# EAGLE design LilyPad-Accelerometer-v20 (EAGLE 5.04)
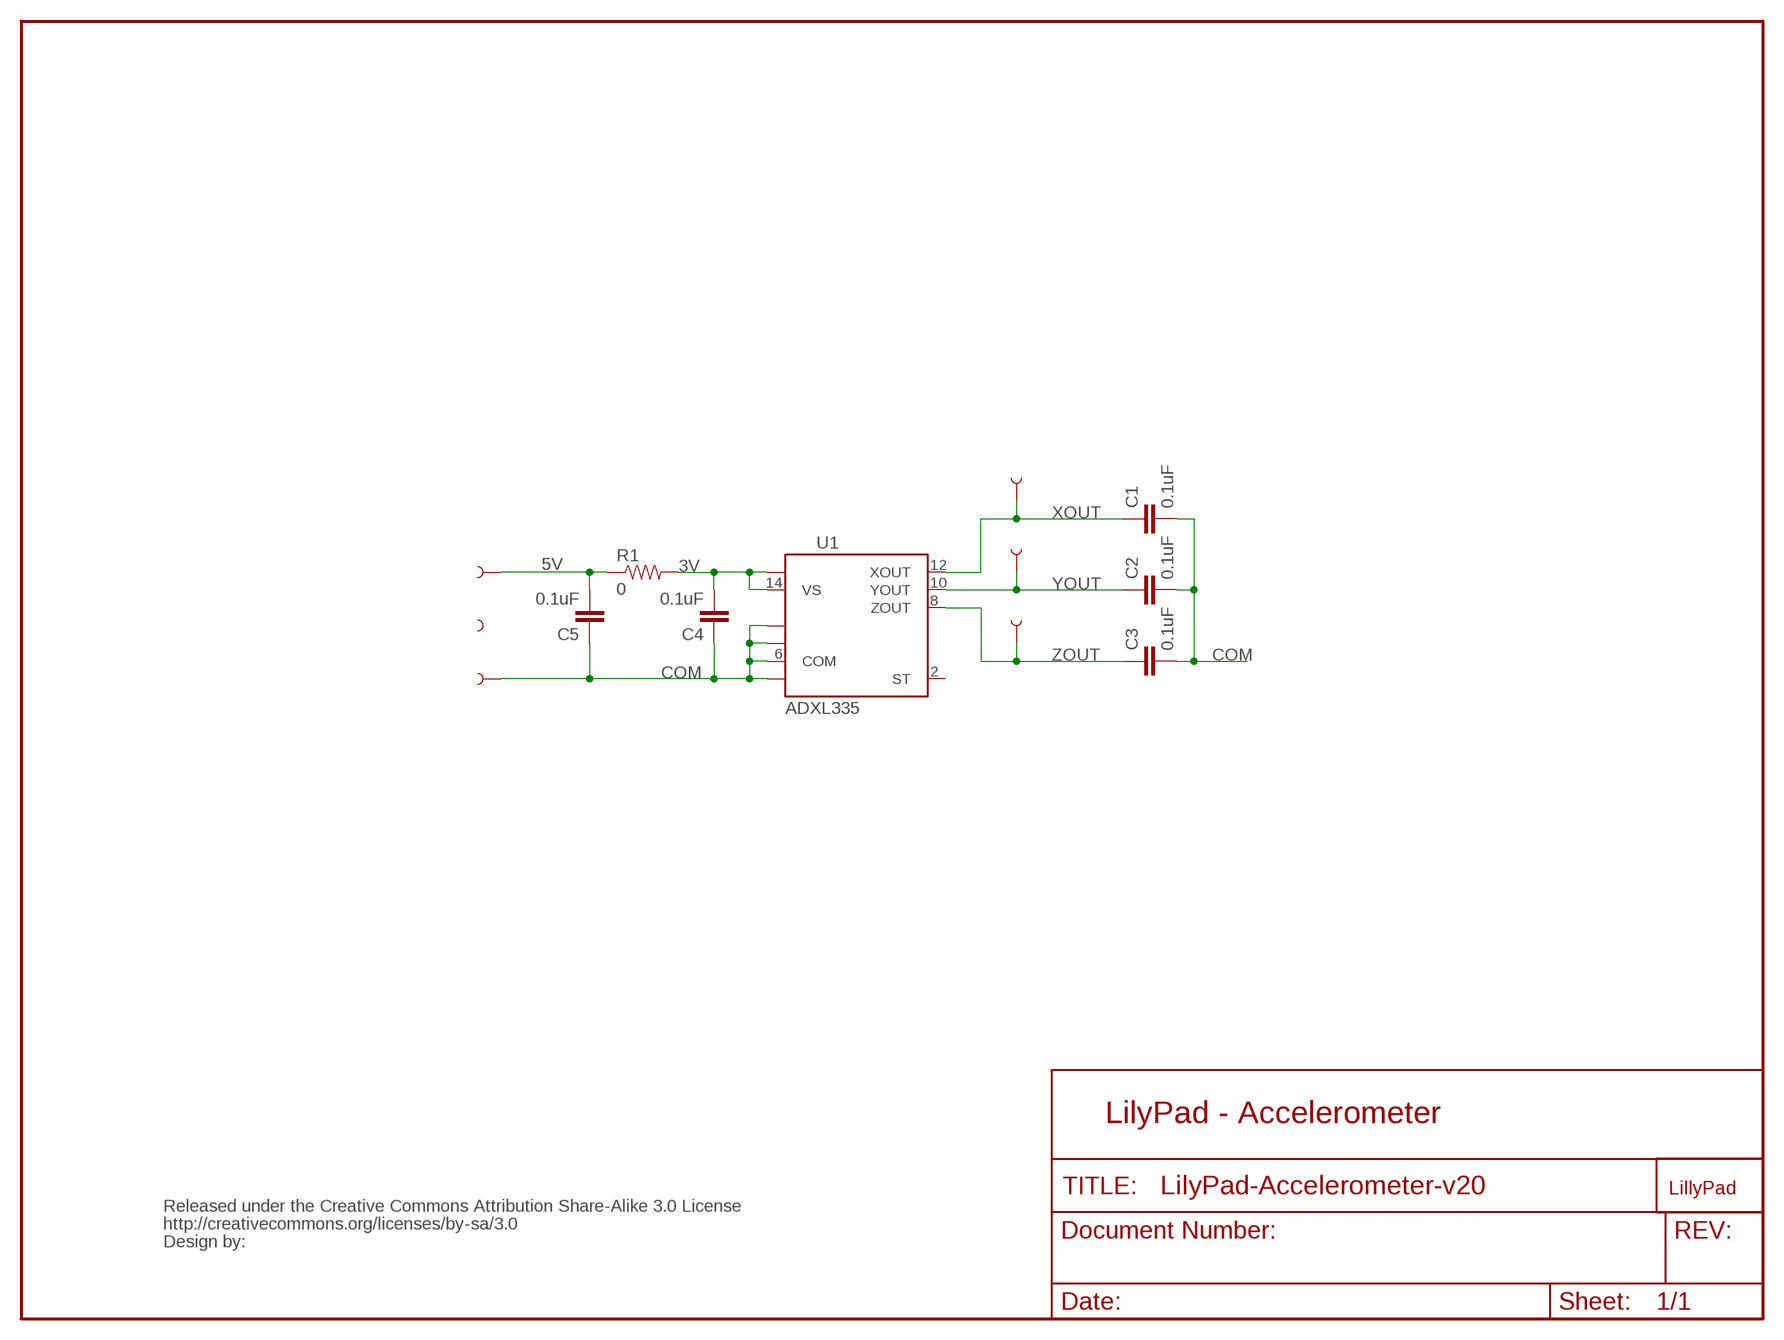
[diagram p0: schematic, sheet 1]

## Parts
C1  0.1uF  CAP0402-CAP  [0402-CAP]
C2  0.1uF  CAP0402-CAP  [0402-CAP]
C3  0.1uF  CAP0402-CAP  [0402-CAP]
C4  0.1uF  CAP0402-CAP  [0402-CAP]
C5  0.1uF  CAP0402-CAP  [0402-CAP]
J1  SEWTAP6  [PETAL-SMALL-2SIDE]
J2  SEWTAP6  [PETAL-SMALL-2SIDE]
J3  SEWTAP6  [PETAL-SMALL-2SIDE]
J4  SEWTAP6  [PETAL-SMALL-2SIDE]
J5  SEWTAP6  [PETAL-SMALL-2SIDE]
J6  SEWTAP-NOHOLE2  [PETAL-NOHOLE-2SIDE]
R1  0  RESISTOR0402-RES  [0402-RES]
U1  ADXL335  [LFCSP-16]
U$4  LOGO-LP  LOGO-LPLP  [LOGO-LILYPAD]
U$7  CREATIVE_COMMONS  [CREATIVE_COMMONS]

## Nets
3V: C4.2 R1.2 U1.14(VS) U1.15(VS)
5V: C5.2 J4.1 R1.1
COM: C1.2 C2.2 C3.2 C4.1 C5.1 J5.1 U1.3(COM) U1.5(COM) U1.6(COM) U1.7(COM)
XOUT: C1.1 J1.1 U1.12(XOUT)
YOUT: C2.1 J2.1 U1.10(YOUT)
ZOUT: C3.1 J3.1 U1.8(ZOUT)
Unconnected: U1.2(ST)

## Notes on the sheet
- LilyPad - Accelerometer

## Library data of the parts
C1-C5 = SparkFun:CAP: Capacitor Standard 0603 ceramic capacitor, and 0.1" leaded capacitor.
J1-J5 = LilyPad-Wearables:SEWTAP
J6 = LilyPad-Wearables:SEWTAP-NOHOLE
R1 = SparkFun:RESISTOR: Resistor Basic schematic elements and footprints for 0603, 1206, and PTH resistors.
U1 = SparkFun:ADXL335
U$4 = LilyPad-Wearables:LOGO-LP
U$7 = SparkFun:CREATIVE_COMMONS

## Board
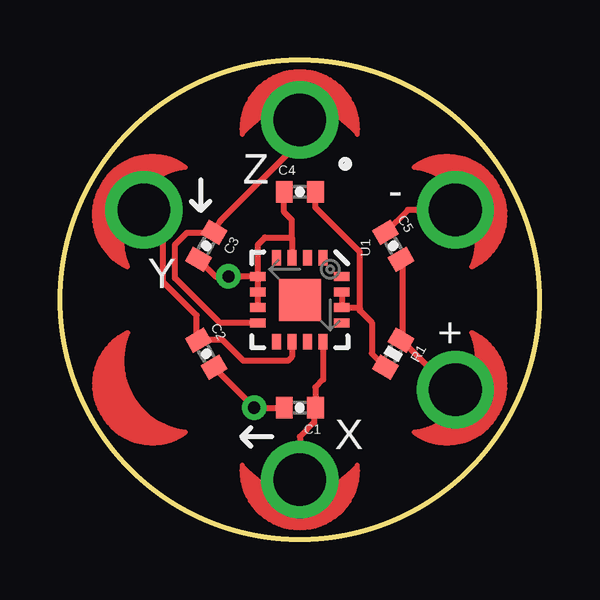
[diagram p1: board, top side]
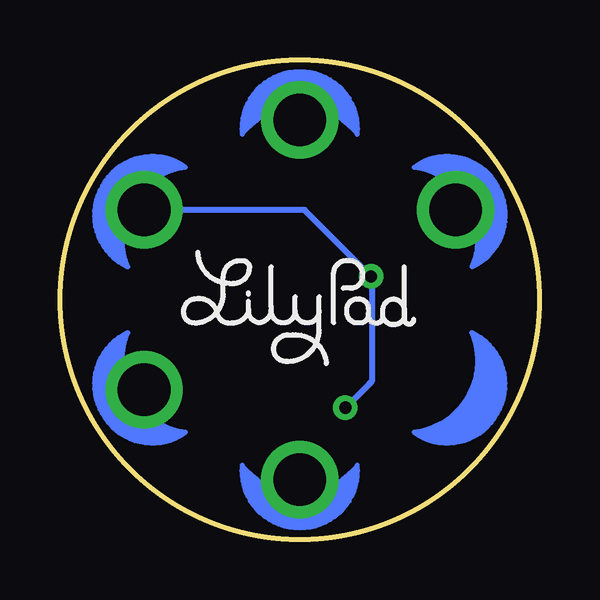
[diagram p2: board, bottom side, seen from below]

Size 20 x 20 mm. Coordinates in mm from the lower left corner, seen from the top.
Outline: circle at 10,10 radius 10
Copper layers (1*16): Top 0.035mm / dielectric 1.5mm / Bottom 0.035mm
Design rules "SparkFun": minimum track width 8mil, minimum drill 20mil, track to track 8mil, track to pad 8mil, pad to pad 8mil, via to via 8mil, smd to smd 8mil, copper to edge 10mil, drill to drill 8mil, minimum pad ring 12mil, minimum via ring 10mil, stop-mask expansion 4mil, vias tented up to drill 20mil, thermal gap 10mil

### Footprints (pad centres in the part's own frame; a part is rotated, then mirrored left to right if it is on the bottom)
0402-CAP = smd 0.7 x 0.9: 1 -0.65,0; 2 0.65,0
PETAL-SMALL-2SIDE = drill 2.2 round: 1 0,0
0402-RES = smd 0.7 x 0.9: 1 -0.65,0; 2 0.65,0
LFCSP-16 = smd 1.75 x 1.75: 0 0,0 | smd 0.65 x 0.37: 1 -1.75,0.975; 2 -1.75,0.325; 3 -1.75,-0.325; 4 -1.75,-0.975; 9 1.75,-0.975; 10 1.75,-0.325; 11 1.75,0.325; 12 1.75,0.975 | smd 0.37 x 0.65: 5 -0.975,-1.75; 6 -0.325,-1.75; 7 0.325,-1.75; 8 0.975,-1.75; 13 0.975,1.75; 14 0.325,1.75; 15 -0.325,1.75; 16 -0.975,1.75

### Placement (x,y rotation side)
C1  10,5.5 180 top
C2  6.1,7.75 300 top
C3  6.1,12.25 240 top
C4  10,14.5 0 top
C5  13.9,12.25 300 top
J1  10,2.5 0 top
J2  3.5,13.75 240 top
J3  10,17.5 180 top
J4  16.49,6.25 60 top
J5  16.49,13.75 120 top
J6  3.51,6.25 300 top
R1  13.9,7.75 240 top
U1  10,10 270 top
U$4  10,10 0 bottom
U$7  20.16,-9.05 0 top  (outside the outline)

### Tracks (layer width: path | path; a pad name or v marks a point on that pad's centre or on a via)
3V
  Top 0.254: R1.2 13,7.76 13,9.05 12.5,9.55 12.5,9.65 | C4.2 10.65,13.85 12.5,12 12.5,9.65 | 12.5,9.65 12.47,9.68 U1.14 U1.15
5V
  Top 0.254: 14.25,8.3 R1.1 14.24,8.3 14.25,8.3 | 14.25,8.3 14.3,8.3 14.3,11.61 C5.2 | 14.25,8.3 16.3,6.25 J4.1
COM  (via drill 0.51)
  Top 0.254: C5.1 13.55,12.8 14.5,13.75 J5.1 | 9.68,12.6 9.68,13.32 9.35,13.65 C4.1 | C3.2 5.78,11.68 6.47,10.97 | v7.03,10.97 7,10.95 7,11 | 6.47,10.97 6.97,10.97 7,11 | 9.68,12.6 8.55,12.6 8.25,12.3 U1.5 | C2.2 8.1,5.51 v8.1,5.5 C1.2 | v7.03,10.97 7.05,11 | 7,11 v7.03,10.97 | U1.5 6.48,10.97 6.47,10.98 | U1.7 U1.6 | U1.6 U1.5 | 9.68,12.6 U1.3 | U1.6 U1.5 | 6.47,10.98 6.47,10.97 | 6.47,10.98 6.19,11.27
  Bottom 0.254: 7.1,6.5 v8.1,5.5 | 7.1,6.5 7.03,6.58 | 7.1,6.5 7,6.6 7,10.95 v7.03,10.97 9.8,13.75 J5.1
XOUT
  Top 0.254: U1.12 10.97,6.67 10.65,6.35 C1.1 10.6,5.5 10.6,4.88 10,4.29 J1.1
YOUT
  Top 0.254: 5.75,8.3 5.76,8.31 C2.1 | C2.1 6.79,8.31 7.65,7.45 9.5,7.45 9.68,7.62 U1.10 | J2.1 4.3,13.3 4.3,10.75 5.7,9.35 5.7,8.3 5.76,8.3 C2.1
ZOUT
  Top 0.254: 6.4,12.8 C3.1 | 6.4,12.8 6.7,13.3 10,16.6 J3.1 | 6.4,12.8 6.41,12.81 C3.1 | 6.4,12.8 6.41,12.8 C3.1 | 6.4,12.8 5.3,12.8 4.8,12.3 4.8,10.9 6.67,9.03 U1.8

### Text on the board
tPlace: Z | - | Y | + | X